# Altium schematic sheet SensorSlot2.SchDoc: Titel
size A4; ApprovedBy: name; CompanyName: DCI Electronics bv; DrawnBy: KRS; Address1: Nijverheidsstraat 14; Address2: 4458 AV Eindewege; Address3: Phone: +31 (0)113 344880; DocumentNumber: 13; Revision: 1; SheetNumber: 13; SheetTotal: 14; PageSetup: Record=PageOptions|CenterHorizontal=True|CenterVertical=True|PrintScale=1.00|XCorrection=1.00|YCorrection=1.00|PrintKind=1|BorderSize=5000000|LeftOffset=0|BottomOffset=0|Orientation=2|PaperLength=1000|PaperWidth=1000|Scale=100|PaperSource=7|PrintQuality=-4|MediaType=1|DitherType=10|PaperKind=ISO_A4_(210.00_x_297.00_MM)|PrintScaleMode=1; SubTitle: SubTitel; ApprovedDate: 01-01-12
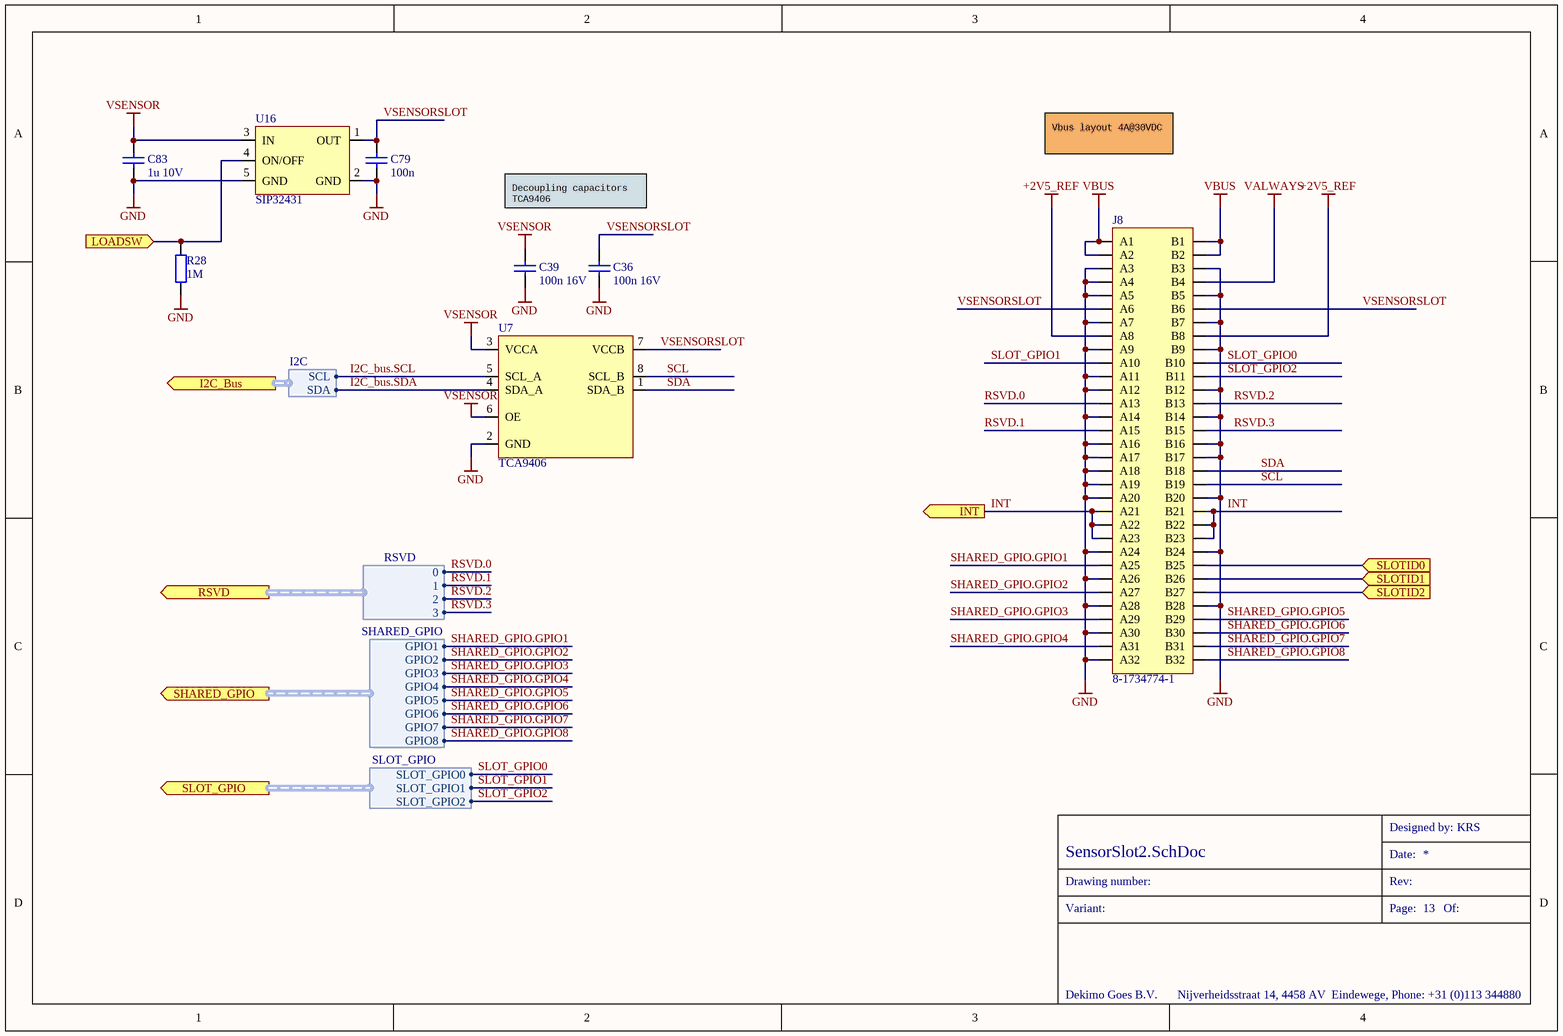
[diagram p0: SensorSlot2.SchDoc]

## Parts
C36  100n 16V  [CAPC1005X05N]
C39  100n 16V  [CAPC1005X05N]
C79  100n  [CAPC1608X09N]
C83  1u 10V  [CAPC1608X09N]
J8  8-1734774-1  [CON-601065-064]
R28  1M  [RESC1005x04N]
U7  TCA9406  [SOP-650002-008]
U16  SIP32431  [DFN-500001-004]

## Ports
I2C_Bus (out, harness I2C), INT (out), LOADSW (in), RSVD (out, harness RSVD), SHARED_GPIO (out, harness SHARED_GPIO), SLOT_GPIO (out, harness SLOT_GPIO), SLOTID0 (in), SLOTID1 (in), SLOTID2 (in)

## Harnesses
SHARED_GPIO: GPIO1, GPIO2, GPIO3, GPIO4, GPIO5, GPIO6, GPIO7, GPIO8
SLOT_GPIO: SLOT_GPIO0, SLOT_GPIO1, SLOT_GPIO2
RSVD: 0, 1, 2, 3
I2C: SCL, SDA

## Nets
+2V5_REF: J8.A8 J8.B8
GND: C36.1 C39.1 C79.1 C83.1 J8.A3 J8.A4 J8.A5 J8.A7 J8.A9 J8.A11 J8.A12 J8.A14 J8.A16 J8.A17 J8.A18 J8.A19 J8.A20 J8.A24 J8.A26 J8.A28 J8.A30 J8.A32 J8.B3 J8.B5 J8.B7 J8.B9 J8.B12 J8.B14 J8.B16 J8.B17 J8.B20 J8.B24 J8.B28 R28.1 U7.2(GND) U16.2(GND) U16.5(GND)
VALWAYS: J8.B4
VBUS: J8.A1 J8.A2 J8.B1 J8.B2
VSENSOR: C39.2 C83.2 U7.3(VCCA) U7.6(OE) U16.3(IN)
I2C_bus.SCL: U7.5(SCL_A) ; port I2C_Bus.SCL
I2C_bus.SDA: U7.4(SDA_A) ; port I2C_Bus.SDA
INT: J8.A21 J8.A22 J8.A23 J8.B21 J8.B22 J8.B23 ; port INT
LOADSW: R28.2 U16.4(ON/OFF) ; port LOADSW
RSVD.0: J8.A13 ; port RSVD.0
RSVD.1: J8.A15 ; port RSVD.1
RSVD.2: J8.B13 ; port RSVD.2
RSVD.3: J8.B15 ; port RSVD.3
SCL: J8.B19 U7.8(SCL_B)
SDA: J8.B18 U7.1(SDA_B)
SHARED_GPIO.GPIO1: J8.A25 ; port SHARED_GPIO.GPIO1
SHARED_GPIO.GPIO2: J8.A27 ; port SHARED_GPIO.GPIO2
SHARED_GPIO.GPIO3: J8.A29 ; port SHARED_GPIO.GPIO3
SHARED_GPIO.GPIO4: J8.A31 ; port SHARED_GPIO.GPIO4
SHARED_GPIO.GPIO5: J8.B29 ; port SHARED_GPIO.GPIO5
SHARED_GPIO.GPIO6: J8.B30 ; port SHARED_GPIO.GPIO6
SHARED_GPIO.GPIO7: J8.B31 ; port SHARED_GPIO.GPIO7
SHARED_GPIO.GPIO8: J8.B32 ; port SHARED_GPIO.GPIO8
SLOT_GPIO0: J8.B10 ; port SLOT_GPIO.SLOT_GPIO0
SLOT_GPIO1: J8.A10 ; port SLOT_GPIO.SLOT_GPIO1
SLOT_GPIO2: J8.B11 ; port SLOT_GPIO.SLOT_GPIO2
SLOTID0: J8.B25 ; port SLOTID0
SLOTID1: J8.B26 ; port SLOTID1
SLOTID2: J8.B27 ; port SLOTID2
VSENSORSLOT: C36.2 C79.2 J8.A6 J8.B6 U7.7(VCCB) U16.1(OUT)

## Notes on the sheet
- Vbus layout 4A@30VDC
- Decoupling capacitors
  TCA9406
- Designed by:
- Drawing number:
- Variant:
- Date:
- Page:
- Rev:
- Of:
- Dekimo Goes B.V.
- Nijverheidsstraat 14, 4458 AV  Eindewege, Phone: +31 (0)113 344880

## Library data of the parts
C36 C39 = CKE 100N/70: 100nF, 16V, 10%, X7R; EngPartGrpMainCode: CAP; ManufactpartCode: CC0402KRX7R7BB104-YAG; Type: Capacitor ceramic SMD; Preferred: False; SMD_Flag: True; PartCode: CKE 100N/70
C79 = CKE 100N/60: 100nF 50V 10% X7R; EngPartGrpMainCode: CAP; ManufactpartCode: 2238 586 15649-PHI; Type: Capacitor ceramic SMD; Preferred: False; SMD_Flag: True; PartCode: CKE 100N/60
C83 = CKE 1U/60: 1UF, 10V, 10%, 0603, X5R; EngPartGrpMainCode: CAP; ManufactpartCode: 0603ZD105KAT2A-AVX; Type: Capacitor ceramic SMD; Preferred: False; SMD_Flag: True; PartCode: CKE 1U/60
J8 = CON BTOB64S/1: PCIE x4 64pos; EngPartGrpMainCode: CONN; ManufactpartCode: 8-1734774-1-TEC; Preferred: False; PartCode: CON BTOB64S/1; Type: Connector various; SMD_Flag: False
R28 = R 1M/70: 1M, 62.5mW, 1%; PartCode: R 1M/70; EngPartGrpMainCode: RES; ManufactpartCode: RC0402FR-071ML-YAG; Preferred: False; SMD_Flag: True; Type: Resistor metalfilm SMD
U7 = IC TCA9406: I2C Level translator; EngPartGrpMainCode: IC; ManufactpartCode: TCA9406DCTR-TI; Preferred: False; SMD_Flag: True; PartCode: IC TCA9406; Type: IC driver SMD
U16 = IC SIP32431DN: load sw, 5.5V, 10pA Ishutdown; EngPartGrpMainCode: IC; ManufactpartCode: SIP32431DNP3-T1GE4-VIS; Preferred: False; SMD_Flag: True; PartCode: IC SIP32431DN; Type: IC switch SMD